# Altium schematic sheet Control.SchDoc
size A4; DocumentNumber: 1; SheetNumber: 2; SheetTotal: 7
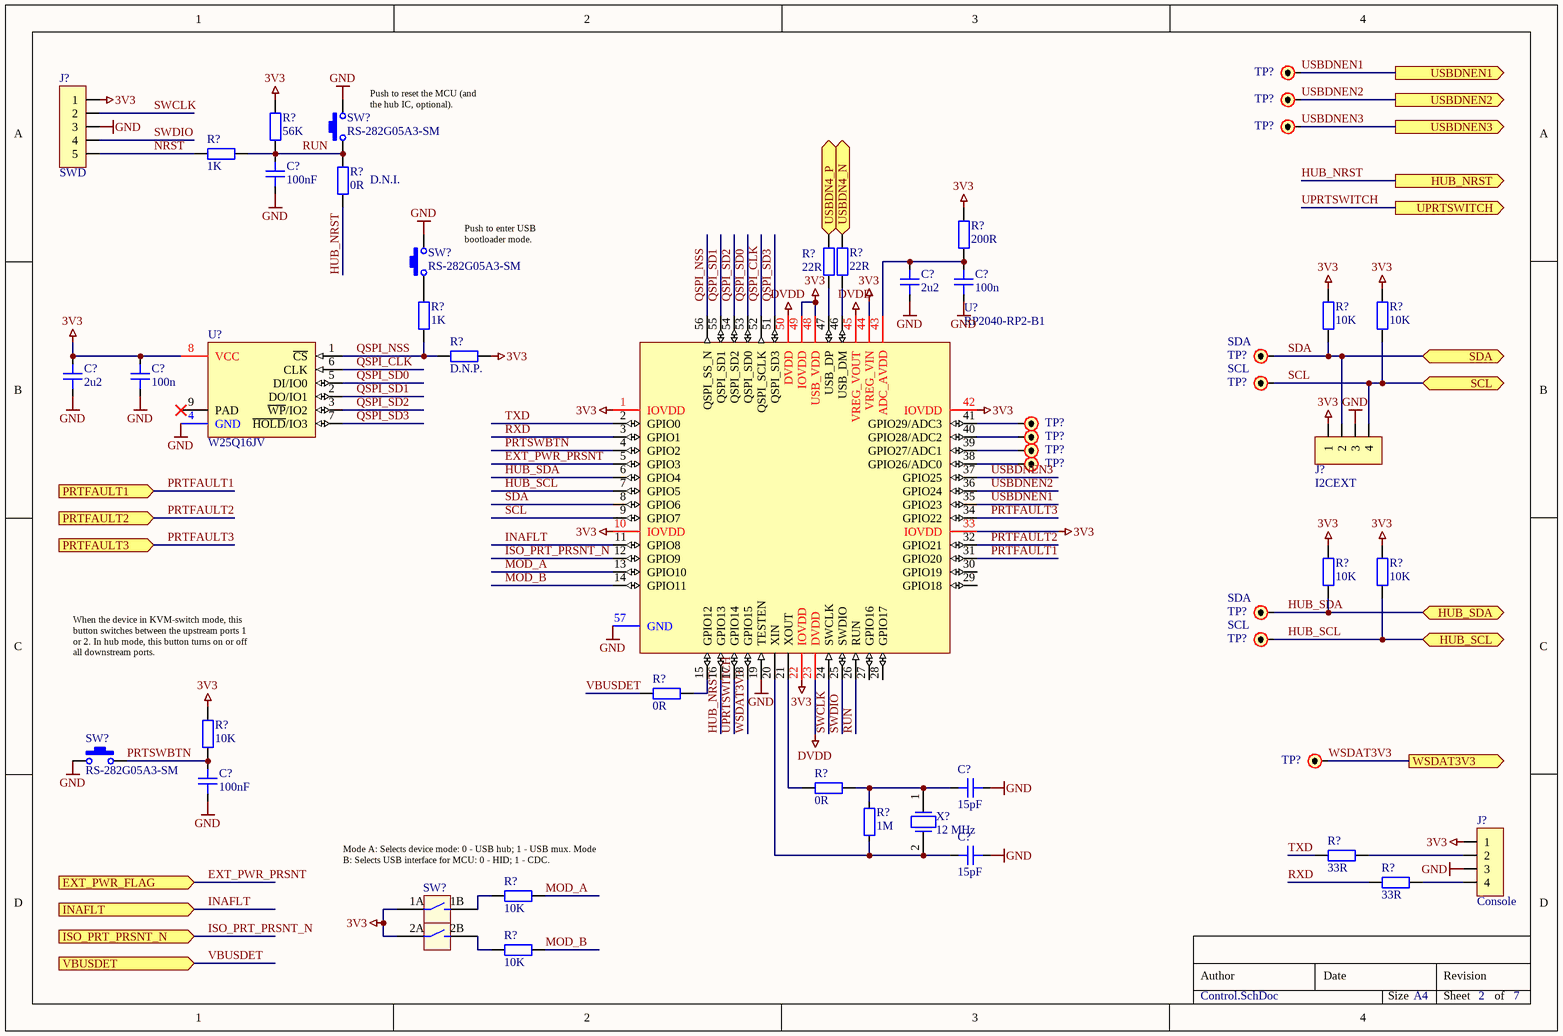
[diagram p0: Control.SchDoc]

## Parts
(Parts that share a designator on the sheet are numbered #1, #2 ... from top to bottom, then left to right.)
C?#1  100nF  [0603C_RF_M]
C?#2  2u2  [0805C_RF_M]
C?#3  100n  [0805C_RF_M]
C?#4  2u2  [0603C_RF_M]
C?#5  100n  [0603C_RF_M]
C?#6  100nF  [0603C_RF_M]
C?#7  15pF  [0603C_RF_M]
C?#8  15pF  [0603C_RF_M]
J?#1  SWD  [HEADER-2.54-5P1]
J?#2  I2CEXT  [HEADER-2.54-4P1]
J?#3  Console  [HEADER-2.54-4P1]
R?#1  56K  [0603R_RF_M]
R?#2  1K  [0603R_RF_M]
R?#3  0R  [0603R_RF_M]
R?#4  200R  [0805R_RF_M]
R?#5  1K  [0603R_RF_M]
R?#6  22R  [0805R_RF_M]
R?#7  22R  [0805R_RF_M]
R?#8  10K  [0603R_RF_M]
R?#9  10K  [0603R_RF_M]
R?#10  D.N.P.  [0603R_RF_M]
R?#11  10K  [0603R_RF_M]
R?#12  10K  [0603R_RF_M]
R?#13  0R  [0805R_RF_M]
R?#14  10K  [0805R_RF_M]
R?#15  0R  [0805R_RF_M]
R?#16  1M  [0805R_RF_M]
R?#17  33R  [0805R_RF_M]
R?#18  33R  [0805R_RF_M]
R?#19  10K  [0805R_RF_M]
R?#20  10K  [0805R_RF_M]
SW?#1  RS-282G05A3-SM  [RS-282G05A3-SM]
SW?#2  RS-282G05A3-SM  [RS-282G05A3-SM]
SW?#3  RS-282G05A3-SM  [RS-282G05A3-SM]
SW?#4  WURTH_418117270902  [WURTH_418117270902]  (value not drawn)
TP?#1  Test Point  [PAD_R_1MM]  (value not drawn)
TP?#2  Test Point  [PAD_R_1MM]  (value not drawn)
TP?#3  Test Point  [PAD_R_1MM]  (value not drawn)
TP?#4  SDA  [PAD_R_1.5MM]
TP?#5  SCL  [PAD_R_1.5MM]
TP?#6  Test Point  [PAD_R_1MM]  (value not drawn)
TP?#7  Test Point  [PAD_R_1MM]  (value not drawn)
TP?#8  Test Point  [PAD_R_1MM]  (value not drawn)
TP?#9  Test Point  [PAD_R_1MM]  (value not drawn)
TP?#10  SDA  [PAD_R_1.5MM]
TP?#11  SCL  [PAD_R_1.5MM]
TP?#12  Test Point  [PAD_R_1MM]  (value not drawn)
U?#1  W25Q16JV  [MCHP_USON-8]
U?#2  RP2040-RP2-B1  [RP2040-QFN-56]
X?  12 MHz  [XTAL_3215]

## Ports
EXT_PWR_FLAG (in), HUB_NRST (out), HUB_SCL (bidir), HUB_SDA (bidir), INAFLT (in), ISO_PRT_PRSNT_N (in), PRTFAULT1 (in), PRTFAULT2 (in), PRTFAULT3 (in), SCL (bidir), SDA (bidir), UPRTSWITCH (out), USBDN4_N (bidir), USBDN4_P (bidir), USBDNEN1 (out), USBDNEN2 (out), USBDNEN3 (out), VBUSDET (in), WSDAT3V3 (out)

## Nets
3V3: C?#4.2 C?#5.2 J?#1.1 J?#2.1 J?#3.1 R?#1.1 R?#4.2 R?#8.2 R?#9.2 R?#10.1 R?#11.2 R?#12.2 R?#14.2 U?#1.8(VCC) U?#2.1(IOVDD) U?#2.10(IOVDD) U?#2.22(IOVDD) U?#2.33(IOVDD) U?#2.42(IOVDD) U?#2.44(VREG_VIN) U?#2.48(USB_VDD) U?#2.49(IOVDD)
DVDD: U?#2.23(DVDD) U?#2.45(VREG_VOUT) U?#2.50(DVDD)
GND: C?#1.1 C?#2.1 C?#3.1 C?#4.1 C?#5.1 C?#6.2 C?#7.2 C?#8.2 J?#1.3 J?#2.3 J?#3.3 SW?#1.2 SW?#2.2 SW?#3.1 U?#1.4(GND) U?#2.19(TESTEN) U?#2.57(GND)
EXT_PWR_PRSNT: U?#2.5(GPIO3) ; port EXT_PWR_FLAG
HUB_NRST: R?#3.2 U?#2.16(GPIO13) ; port HUB_NRST
HUB_SCL: R?#12.1 TP?#11.1 U?#2.7(GPIO5) ; port HUB_SCL
HUB_SDA: R?#11.1 TP?#10.1 U?#2.6(GPIO4) ; port HUB_SDA
INAFLT: U?#2.11(GPIO8) ; port INAFLT
ISO_PRT_PRSNT_N: U?#2.12(GPIO9) ; port ISO_PRT_PRSNT_N
MOD_A: R?#19.2 U?#2.13(GPIO10)
MOD_B: R?#20.2 U?#2.14(GPIO11)
NRST: J?#1.5 R?#2.2
PRTFAULT1: U?#2.31(GPIO20) ; port PRTFAULT1
PRTFAULT2: U?#2.32(GPIO21) ; port PRTFAULT2
PRTFAULT3: U?#2.34(GPIO22) ; port PRTFAULT3
PRTSWBTN: C?#6.1 R?#14.1 SW?#3.2 U?#2.4(GPIO2)
QSPI_CLK: U?#1.6(CLK) U?#2.52(QSPI_SCLK)
QSPI_NSS: R?#5.2 R?#10.2 U?#1.1(~{CS}) U?#2.56(QSPI_SS_N)
QSPI_SD0: U?#1.5(DI/IO0) U?#2.53(QSPI_SD0)
QSPI_SD1: U?#1.2(DO/IO1) U?#2.55(QSPI_SD1)
QSPI_SD2: U?#1.3(~{WP}/IO2) U?#2.54(QSPI_SD2)
QSPI_SD3: U?#1.7(~{HOLD}/IO3) U?#2.51(QSPI_SD3)
RUN: C?#1.2 R?#1.2 R?#2.1 R?#3.1 SW?#1.1 U?#2.26(RUN)
RXD: R?#18.1 U?#2.3(GPIO1)
SCL: J?#2.4 R?#9.1 TP?#5.1 U?#2.9(GPIO7) ; port SCL
SDA: J?#2.2 R?#8.1 TP?#4.1 U?#2.8(GPIO6) ; port SDA
SWCLK: J?#1.2 U?#2.24(SWCLK)
SWDIO: J?#1.4 U?#2.25(SWDIO)
TXD: R?#17.1 U?#2.2(GPIO0)
UPRTSWITCH: U?#2.17(GPIO14) ; port UPRTSWITCH
USBDN4_N: R?#7.2 ; port USBDN4_N
USBDN4_P: R?#6.2 ; port USBDN4_P
USBDNEN1: TP?#1.1 U?#2.35(GPIO23) ; port USBDNEN1
USBDNEN2: TP?#2.1 U?#2.36(GPIO24) ; port USBDNEN2
USBDNEN3: TP?#3.1 U?#2.37(GPIO25) ; port USBDNEN3
VBUSDET: R?#13.2 ; port VBUSDET
WSDAT3V3: TP?#12.1 U?#2.18(GPIO15) ; port WSDAT3V3
NetC?#2_2: C?#2.2 C?#3.2 R?#4.1 U?#2.43(ADC_AVDD)
NetC?#7_1: C?#7.1 R?#15.1 R?#16.2 X?.1
NetC?#8_1: C?#8.1 R?#16.1 U?#2.20(XIN) X?.2
NetJ?#3_2: J?#3.2 R?#17.2
NetJ?#3_4: J?#3.4 R?#18.2
NetR?#5_1: R?#5.1 SW?#2.1
NetR?#6_1: R?#6.1 U?#2.47(USB_DP)
NetR?#7_1: R?#7.1 U?#2.46(USB_DM)
NetR?#13_1: R?#13.1 U?#2.15(GPIO12)
NetR?#15_2: R?#15.2 U?#2.21(XOUT)
NetTP?#6_1: TP?#6.1 U?#2.41(GPIO29/ADC3)
NetTP?#7_1: TP?#7.1 U?#2.40(GPIO28/ADC2)
NetTP?#8_1: TP?#8.1 U?#2.39(GPIO27/ADC1)
NetTP?#9_1: TP?#9.1 U?#2.38(GPIO26/ADC0)

Not connected (* = marked no-connect by the designer): R?#19 1; R?#20 1; SW?#4 1A 1B 2A 2B; U?#1 9(PAD)*; U?#2 27(GPIO16) 28(GPIO17) 29(GPIO18) 30(GPIO19)

## Notes on the sheet
- (near SW?#1) Push to reset the MCU (and the hub IC, optional).
- D.N.I.
- (near SW?#2) Push to enter USB bootloader mode.
- When the device in KVM-switch mode, this button switches between the upstream ports 1 or 2. In hub mode, this button turns on or off all downstream ports.
- Mode A: Selects device mode: 0 - USB hub; 1 - USB mux. Mode B: Selects USB interface for MCU: 0 - HID; 1 - CDC.
- Author
- Date
- Revision
- Size
- A4
- Sheet
- of

## Library data of the parts
C?#1-C?#8 = C: Capacitor; Manufacturer: Generic Brand; Max Voltage: ? V; Tolerance: ?; Mounting Technology: SMT; Tag: *; Manufacturer Part No: *; Supplier: *; Supplier Link: http://; Supplier Part No: *; Category: Capacitor
  C?#1 C?#6: Value: 100nF
  C?#2 C?#4: Value: 2u2
  C?#3 C?#5: Value: 100n
  C?#7 C?#8: Value: 15pF
J?#1 = PINHDR-5P1: Generic Pin Header 5x1
J?#2 J?#3 = PINHDR-4P1: Generic Pin Header 4x1
R?#1-R?#20 = R: Resistor; Manufacturer: Generic Brand; Power Rating: ? W; Max Voltage: ? V; Tolerance: ?; Supplier Link: http://; Category: Resistor; Mounting Technology: SMT
  R?#1: Value: 56K
  R?#2 R?#5: Value: 1K
  R?#3 R?#13 R?#15: Value: 0R
  R?#4: Value: 200R
  R?#6 R?#7: Value: 22R
  R?#8 R?#9 R?#11 R?#12 R?#14 R?#19 R?#20: Value: 10K
  R?#10: Value: D.N.P.
  R?#16: Value: 1M
  R?#17 R?#18: Value: 33R
SW?#1-SW?#3 = RS-282G05A3-SM: SWITCH TACTILE SPST-NO 0.05A 12V; Manufacturer: C&K; Product Number: RS-282G05A3-SM RT; Supplier: DigiKey; Supplier Link: https://www.digikey.com/en/products/detail/c-k/RS-282G05A3-SM-RT/2747190; Supplier Part No: CKN10384CT-ND; Mounting Technology: SMT; Package: Non-Standard
SW?#4 = WURTH_418117270902: DIP SWITCH SPST 2.54 PITCH RA; Manufacturer: Wurth Elektronik; Compatible Product: DS1040-02RN; Product Number: 418117270902; Mounting Technology: SMT; Package: DIP-4; Supplier: DigiKey; Supplier Link: https://www.digikey.com/en/products/detail/w%C3%BCrth-elektronik/418117270902/3174485; Supplier Part No: 732-3832-5-ND; Alternative Supplier: Chipdip; Alternative Supplier Part No: 9000190955; Alternative Supplier Link: https://www.chipdip.by/product/ds1040-02rn
TP?#1-TP?#12 = Test Point: Test Point / Pad
U?#1 = W25Q16JV: IC FLASH 16MBIT SPI/QUAD 8USON
U?#2 = RP2040-RP2-B1: IC MCU; Manufacturer: Raspberry Pi Foundation; Supplier: DigiKey; Package: VFQFN-56; Mounting Technology: SMT
X? = XT-2P: Crystal Resonator (2 Leads); Manufacturer: Generic Brand; Tolerance: ? ppm; Mounting Technology: SMT; Supplier Link: http://; Category: Crystal; Value: 12 MHz